# EAGLE design Breadboard Power Supply (EAGLE 6.4)
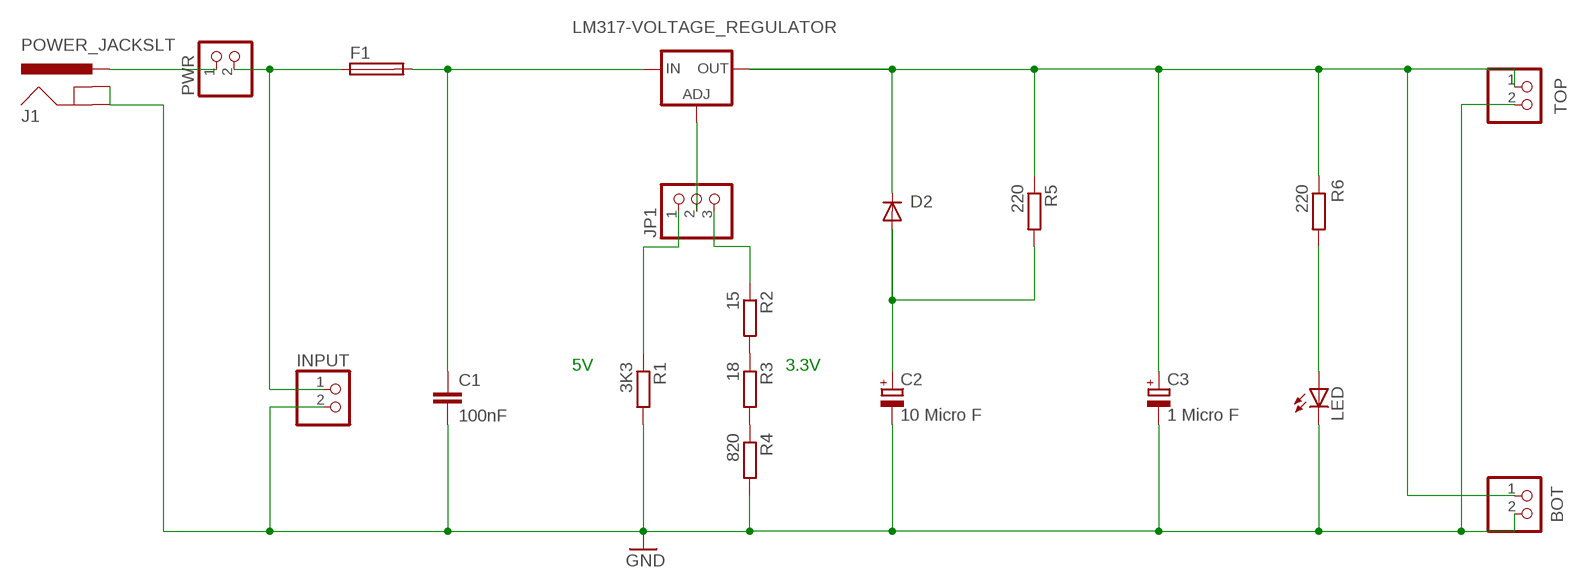
[diagram p0: schematic, sheet 1]

## Parts
BOT  PINHD-1X2  [1X02]
C1  100nF  C-EU025-030X050  [C025-030X050]
C2  10 Micro F  CPOL-EUE2-5  [E2-5]
C3  1 Micro F  CPOL-EUE2-5  [E2-5]
D2  1N4004  [DO41-10]
F1  SH22,5A  [SH22,5A]
INPUT  PINHD-1X2  [1X02]
J1  POWER_JACKSLT  [POWER_JACK_SLOT]
JP1  PINHD-1X3  [1X03]
LED  TLLR4400  [LED3MM]
LM317-VOLTAGE_REGULATOR  LM138-TS  [TO220S]
PWR  PINHD-1X2  [1X02]
R1  3K3  R-EU_0207/12  [0207/12]
R2  15  R-EU_0207/12  [0207/12]
R3  18  R-EU_0207/12  [0207/12]
R4  820  R-EU_0207/12  [0207/12]
R5  220  R-EU_0207/12  [0207/12]
R6  220  R-EU_0207/12  [0207/12]
TOP  PINHD-1X2  [1X02]

## Nets
GND: BOT.2 C1.2 C2.- C3.- INPUT.2 J1.GND@1(GNDBREAK) J1.GND@2(GND) LED.K(C) R1.2 R4.2 TOP.2
N$1: R2.2 R3.1
N$2: R3.2 R4.1
N$3: JP1.3 R2.1
N$4: JP1.1 R1.1
N$6: JP1.2 LM317-VOLTAGE_REGULATOR.1(ADJ)
N$7: C1.1 F1.2 LM317-VOLTAGE_REGULATOR.3(IN)
N$8: BOT.1 C3.+ D2.C LM317-VOLTAGE_REGULATOR.2(OUT) R5.1 R6.1 TOP.1
N$9: C2.+ D2.A R5.2
N$10: J1.PWR PWR.1
N$36: LED.A R6.2
VIN: F1.1 INPUT.1 PWR.2

## Notes on the sheet
- 5V | 3.3V

## Library data of the parts
BOT INPUT PWR TOP = pinhead:PINHD-1X2: PIN HEADER
C1 = rcl:C-EU: CAPACITOR, European symbol
C2 C3 = rcl:CPOL-EU: POLARIZED CAPACITOR, European symbol
D2 = diode:1N4004: DIODE general purpose rectifier, 1 A
F1 = fuse:SH22,5A: FUSE HOLDER grid 22,5mm, isolated cap OGN0031 8201, Schurter (Buerklin); MPN: 0031.7701.11; OC_FARNELL: unknown; OC_NEWARK: 04F1224
J1 = SparkFun:POWER_JACK: Power Jack This is the standard 5.5mm barrel jack for power. The PTH is the most common, proven, reliable, footprint. All others are experimental. The Slot footprint only works if the mill layer is transmitted to the PCB fab house so be warned. Spark Fun Electronics SKU : PRT-00119. Mating wall wart : TOL-00298 (and others)
JP1 = pinhead:PINHD-1X3: PIN HEADER
LED = led:TLLR4400: Low Current (2mA) LED 3 mm Tinted Diffused Package color RED Source: Data sheet <http://www.farnell.com/datasheets/391100.pdf>; MF: VISHAY SEMICONDUCTOR; OC_FARNELL: 1612437
LM317-VOLTAGE_REGULATOR = v-reg:LM138-TS: VOLTAGE REGULATOR
R1-R6 = rcl:R-EU_: RESISTOR, European symbol

## Net classes
0 default: width 0.203 mm

## Board
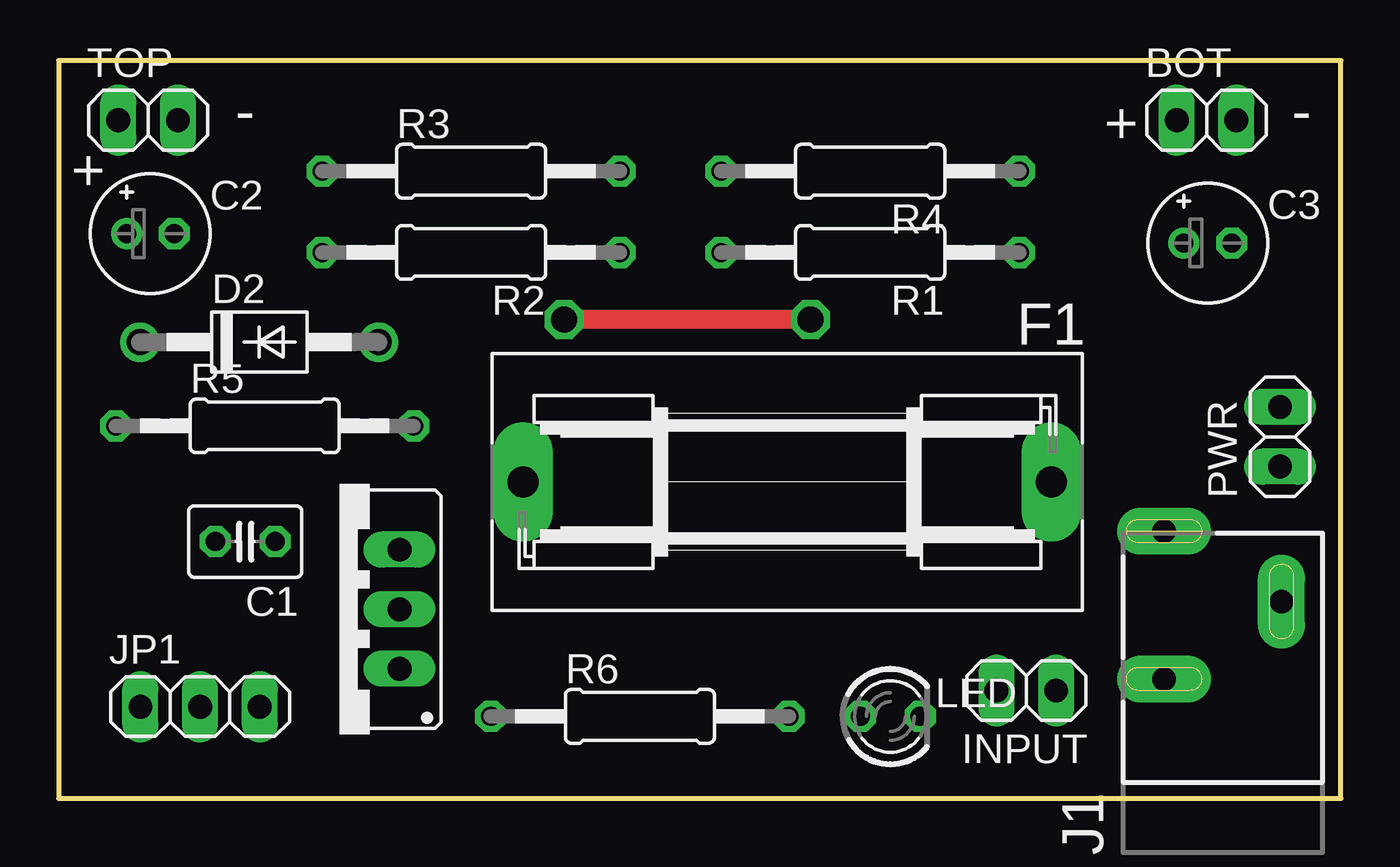
[diagram p1: board, top side]
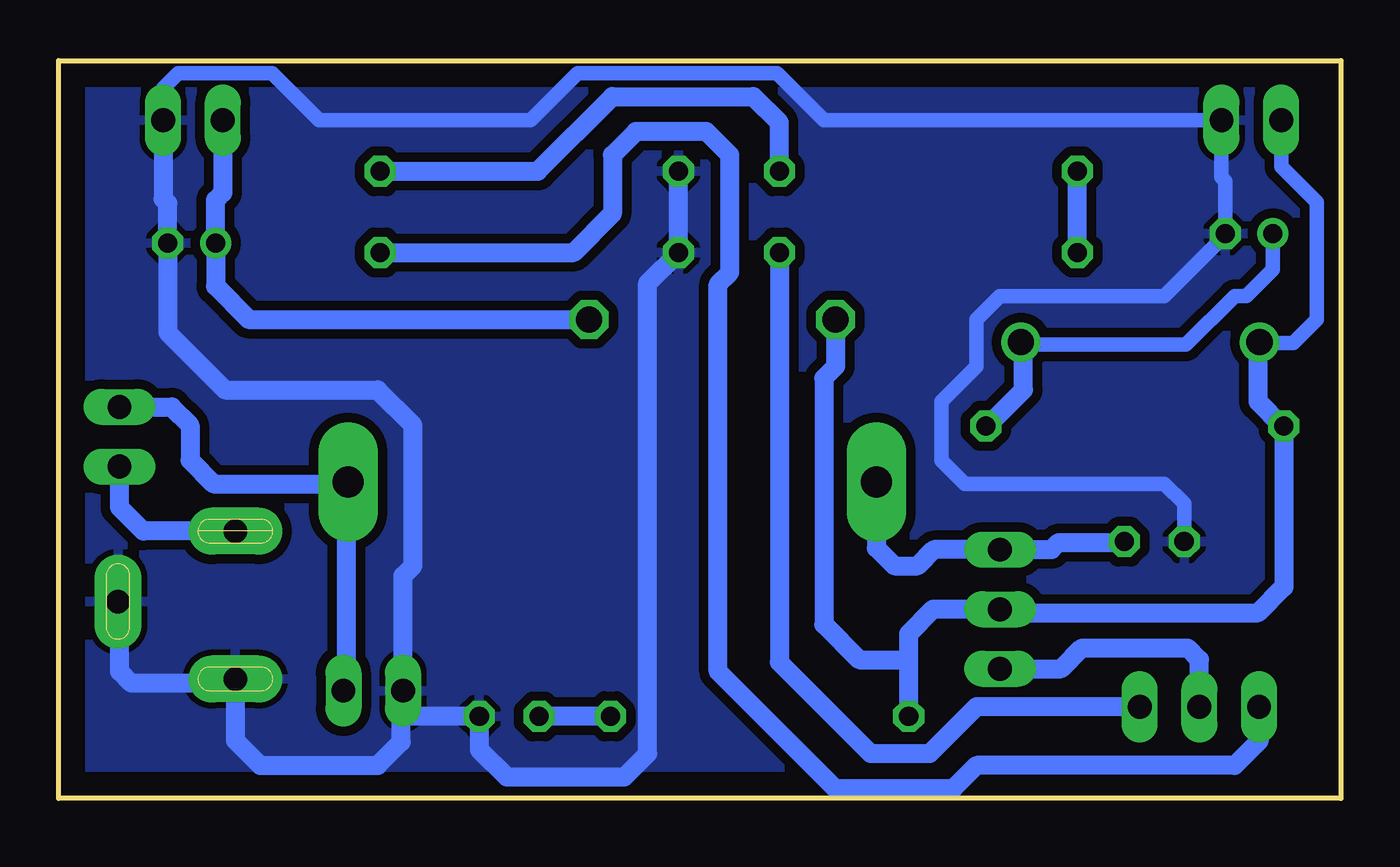
[diagram p2: board, bottom side, seen from below]

Size 54.61 x 31.44 mm. Coordinates in mm from the lower left corner, seen from the top.
Outline: 0,0 54.61,0 54.61,31.44 0,31.44 0,0
Copper layers (1*16): Top 0.035mm / dielectric 1.5mm / Bottom 0.035mm
Design rules "default": minimum track width 10mil, minimum drill 24mil, track to track 8mil, track to pad 8mil, pad to pad 8mil, via to via 8mil, smd to smd 8mil, copper to edge 40mil, drill to drill 8mil, minimum pad ring 10mil, minimum via ring 8mil, stop-mask expansion 4mil, vias tented up to drill 0mil, thermal gap 10mil

### Footprints (pad centres in the part's own frame; a part is rotated, then mirrored left to right if it is on the bottom)
1X02 = drill 1.016 long: 1 -1.27,0; 2 1.27,0
C025-030X050 = drill 0.813 octagon: 1 -1.27,0; 2 1.27,0
E2-5 = drill 0.813 pad 1.27: + -1.016,0 | drill 0.813 pad 1.27 octagon: - 1.016,0
DO41-10 = drill 1.118: A 5.08,0; C -5.08,0
SH22,5A = drill 1.321 pad 2.54 long: 1 -11.252,0; 2 11.252,0
POWER_JACK_SLOT = drill 1 pad 2 long: GND@1 2.58,7.5; GND@2 7.58,10.8; PWR 2.58,13.8
1X03 = drill 1.016 long: 1 -2.54,0; 2 0,0; 3 2.54,0
LED3MM = drill 0.813 octagon: A -1.27,0; K 1.27,0
TO220S = drill 1.016 long: 1 -2.54,-2.54; 2 0,-2.54; 3 2.54,-2.54
0207/12 = drill 0.813 octagon: 1 -6.35,0; 2 6.35,0

### Placement (x,y rotation side)
BOT  48.9,28.9 0 top
C1  7.94,10.95 180 top
C2  3.9,24.06 0 top
C3  48.95,23.67 0 top
D2  8.54,19.44 0 top
F1  31.04,13.48 180 top
INPUT  41.21,4.59 180 top
J1  44.51,-2.41 0 top
JP1  6.02,3.91 0 top
LED  35.43,3.49 0 top
LM317-VOLTAGE_REGULATOR  11.97,8.06 90 top
PWR  52.02,15.41 90 top
R1  34.57,23.26 180 top
R2  17.57,23.26 180 top
R3  17.57,26.72 0 top
R4  34.57,26.73 180 top
R5  8.78,15.88 0 top
R6  24.76,3.5 0 top
TOP  3.81,28.9 0 top

### Tracks (layer width: path | path; a pad name or v marks a point on that pad's centre or on a via)
GND
  Bottom 0.61: BOT.2 50.17,30.26 49.52,30.91 45.52,30.91 43.52,28.91 34.52,28.91 32.52,30.91 24.02,30.91 22.01,28.9 TOP.2 5.08,26.47 4.92,26.31 C2.- 4.92,24.01 7.52,21.41 14.52,21.41 15.52,20.41 15.52,18.41 17.02,16.91 17.02,14.41 16.02,13.41 7.52,13.41 6.67,12.56 C1.2
  Bottom 0.813: J1.GND@2 52.02,8.33 52.02,5.41 51.52,4.91 47.52,4.91 47.52,5.1 J1.GND@1 47.09,2.47 46.02,1.41 41.02,1.41 40.02,2.41 40.02,3.41 | 40.02,3.41 40.02,4.52 INPUT.2 39.94,9.49 39.52,9.91 39.52,15.91 41.02,17.41 47.52,17.41 49.96,19.85 C3.- 49.96,25.35 50.17,25.55 BOT.2 | 40.02,3.41 39.93,3.5 LED.K 36.7,2.08 35.52,0.91 30.52,0.91 29.52,1.91 29.52,21.96 R1.2 R4.2
  pour Bottom (isolate 0.406): 0.02,-0.09 54.52,-0.09 54.52,31.41 0.02,31.41
N$1
  Bottom 0.813: R2.2 R3.1
N$2
  Bottom 0.813: R4.1 34.2,26.73 31.02,29.91 25.02,29.91 23.91,28.8 R3.2
N$3
  Bottom 0.813: JP1.3 15.52,3.91 17.52,1.91 20.02,1.91 23.91,5.8 R2.1
N$4
  Bottom 0.813: JP1.1 3.48,2.45 4.52,1.41 15.52,1.41 16.52,0.41 21.52,0.41 26.52,5.41 26.52,21.91 26.02,22.41 26.02,27.41 27.02,28.41 30.02,28.41 31.02,27.41 31.02,24.91 32.67,23.26 R1.1
N$6
  Bottom 0.813: LM317-VOLTAGE_REGULATOR.1 11.91,5.52 11.02,6.41 6.52,6.41 6.02,5.91 JP1.2
N$7
  Bottom 0.813: C1.1 9.25,10.91 12.02,10.91 12.33,10.6 LM317-VOLTAGE_REGULATOR.3 17.33,10.6 18.02,9.91 19.02,9.91 19.78,10.67 F1.2
N$8  (via drill 1.1)
  Top 0.813: v32.02,20.41 v21.52,20.41
  Bottom 0.61: TOP.1 2.54,26.93 1.02,25.41 1.02,20.41 2.02,19.41 3.43,19.41 D2.C
  Bottom 0.813: R6.1 18.41,5.91 | 18.41,5.91 18.41,7.02 17.37,8.06 LM317-VOLTAGE_REGULATOR.2 14.51,7.91 14.52,7.91 3.52,7.91 2.42,9 R5.1 2.49,15.88 3.52,16.91 3.52,19.39 D2.C | BOT.1 47.62,25.8 47.93,25.5 C3.+ 47.93,21.82 46.52,20.41 v32.02,20.41 | v21.52,20.41 21.52,18.41 22.02,17.91 22.02,7.41 20.52,5.91 18.41,5.91
N$9
  Bottom 0.61: 13.52,19.34 6.59,19.34 4.52,21.41 4.02,21.41 2.89,22.54 C2.+
  Bottom 0.813: R5.2 15.05,15.88 13.52,17.41 13.52,19.34 D2.A
N$10
  Bottom 0.813: J1.PWR 51.01,11.4 52.02,12.41 PWR.1
N$36
  Bottom 0.813: R6.2 LED.A
VIN
  Bottom 0.813: PWR.2 49.79,16.68 49.02,15.91 49.02,14.41 48.02,13.41 42.36,13.41 | 42.36,13.41 F1.1 | 42.36,13.41 42.36,4.72 INPUT.1

### Text on the board
tPlace: - | + | - | +